# Altium schematic sheet ahmed23shaf_AMRadioReceiver__PCB__Sheet_1_2023-12-17.schdoc
size 159 x 143 mm
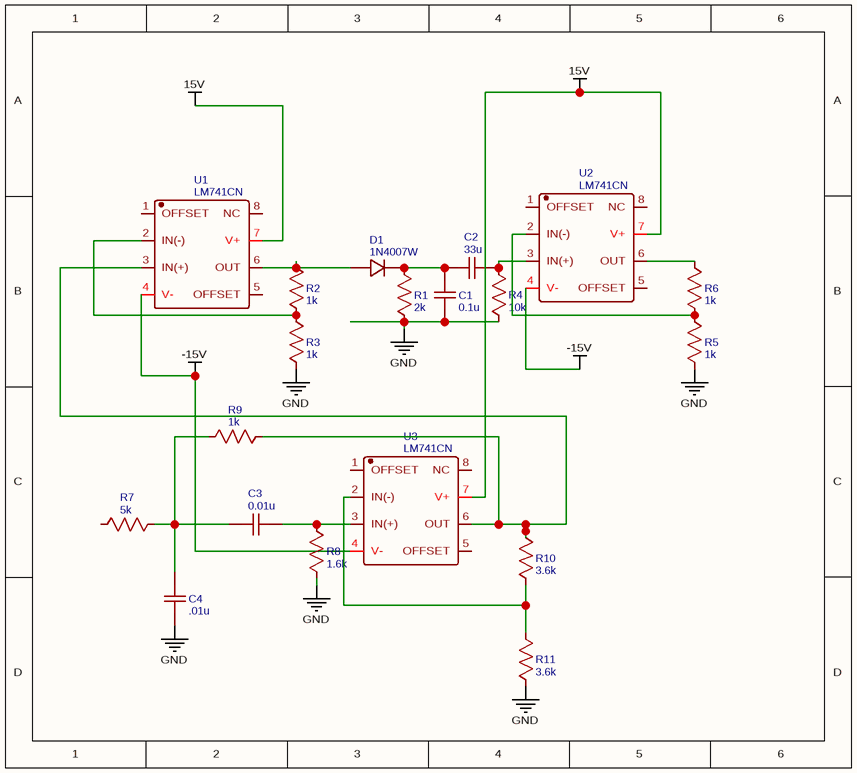
[diagram p0: ahmed23shaf_AMRadioReceiver__PCB__Sheet_1_2023-12-17.schdoc]

## Parts
C1  0.1u  [C0603]
C2  33u  [C0603]
C3  0.01u  [C0603]
C4  .01u  [C0603]
D1  1N4007W  [SOD-123_L2.8-W1.8-LS3.7-RD]
R1  2k  [R0603]
R2  1k  [R0603]
R3  1k  [R0603]
R4  10k  [R0603]
R5  1k  [R0603]
R6  1k  [R0603]
R7  5k  [R0603]
R8  1.6k  [R0603]
R9  1k  [R0603]
R10  3.6k  [R0603]
R11  3.6k  [R0603]
U1  LM741CN  [DIP-8_L9.8-W6.6-P2.54-LS7.6-BL]
U2  LM741CN  [DIP-8_L9.8-W6.6-P2.54-LS7.6-BL]
U3  LM741CN  [DIP-8_L9.8-W6.6-P2.54-LS7.6-BL]

## Nets
15V: U1.7(V+) U2.7(V+) U3.7(V+)
-15V: U1.4(V-) U2.4(V-) U3.4(V-)
GND: C1.1 C4.1 R1.1 R3.1 R4.1 R5.1 R8.1 R11.1
NetC1_2: C1.2 C2.1 D1.1 R1.2
NetC2_2: C2.2 R4.2 U2.3(IN(+))
NetC3_1: C3.1 C4.2 R7.2 R9.1
NetC3_2: C3.2 R8.2 U3.3(IN(+))
NetD1_2: D1.2 R2.2 U1.6(OUT)
NetR2_1: R2.1 R3.2 U1.2(IN(-))
NetR5_2: R5.2 R6.1 U2.2(IN(-))
NetR6_2: R6.2 U2.6(OUT)
NetR9_2: R9.2 R10.2 U1.3(IN(+)) U3.6(OUT)
NetR10_1: R10.1 R11.2 U3.2(IN(-))

Not connected (* = marked no-connect by the designer): R7 1; U1 1(OFFSET) 5(OFFSET) 8(NC); U2 1(OFFSET) 5(OFFSET) 8(NC); U3 1(OFFSET) 5(OFFSET) 8(NC)

## Library data of the parts
C1 = 0.1u: nameAlias: Value(F); Contributor: LCEDA_Lib; spicePre: C; spiceSymbolName: C_0603_US
C2 = 33u: nameAlias: Value(F); Contributor: LCEDA_Lib; spicePre: C; spiceSymbolName: C_0603_US
C3 = 0.01u: nameAlias: Value(F); Contributor: LCEDA_Lib; spicePre: C; spiceSymbolName: C_0603_US
C4 = .01u: nameAlias: Value(F); Contributor: LCEDA_Lib; spicePre: C; spiceSymbolName: C_0603_US
D1 = 1N4007W: Manufacturer: BLUE ROCKET; Contributor: LCEDA_Lib; Supplier: LCSC; Supplier Part: C328592; Manufacturer Part: 1N4007W; spicePre: D; spiceSymbolName: 1N4007W
R1 = 2k: nameAlias: Value(Ω); Contributor: LCEDA_Lib; spicePre: R; spiceSymbolName: R_0603_US
R2 R3 R5 R6 R9 = 1k: nameAlias: Value(Ω); Contributor: LCEDA_Lib; spicePre: R; spiceSymbolName: R_0603_US
R4 = 10k: nameAlias: Value(Ω); Contributor: LCEDA_Lib; spicePre: R; spiceSymbolName: R_0603_US
R7 = 5k: nameAlias: Value(Ω); Contributor: LCEDA_Lib; spicePre: R; spiceSymbolName: R_0603_US
R8 = 1.6k: nameAlias: Value(Ω); Contributor: LCEDA_Lib; spicePre: R; spiceSymbolName: R_0603_US
R10 R11 = 3.6k: nameAlias: Value(Ω); Contributor: LCEDA_Lib; spicePre: R; spiceSymbolName: R_0603_US
U1-U3 = LM741CN: Manufacturer: TI(德州仪器); Manufacturer Part: LM741CN/NOPB; sourceId: DPJ1jBuM4; spicePre: X; Supplier: LCSC; Supplier Part: C13974; JLCPCB Part Class: Extended Part; spiceSymbolName: LM741CN